# Altium schematic sheet Sheet2.SchDoc
size A3
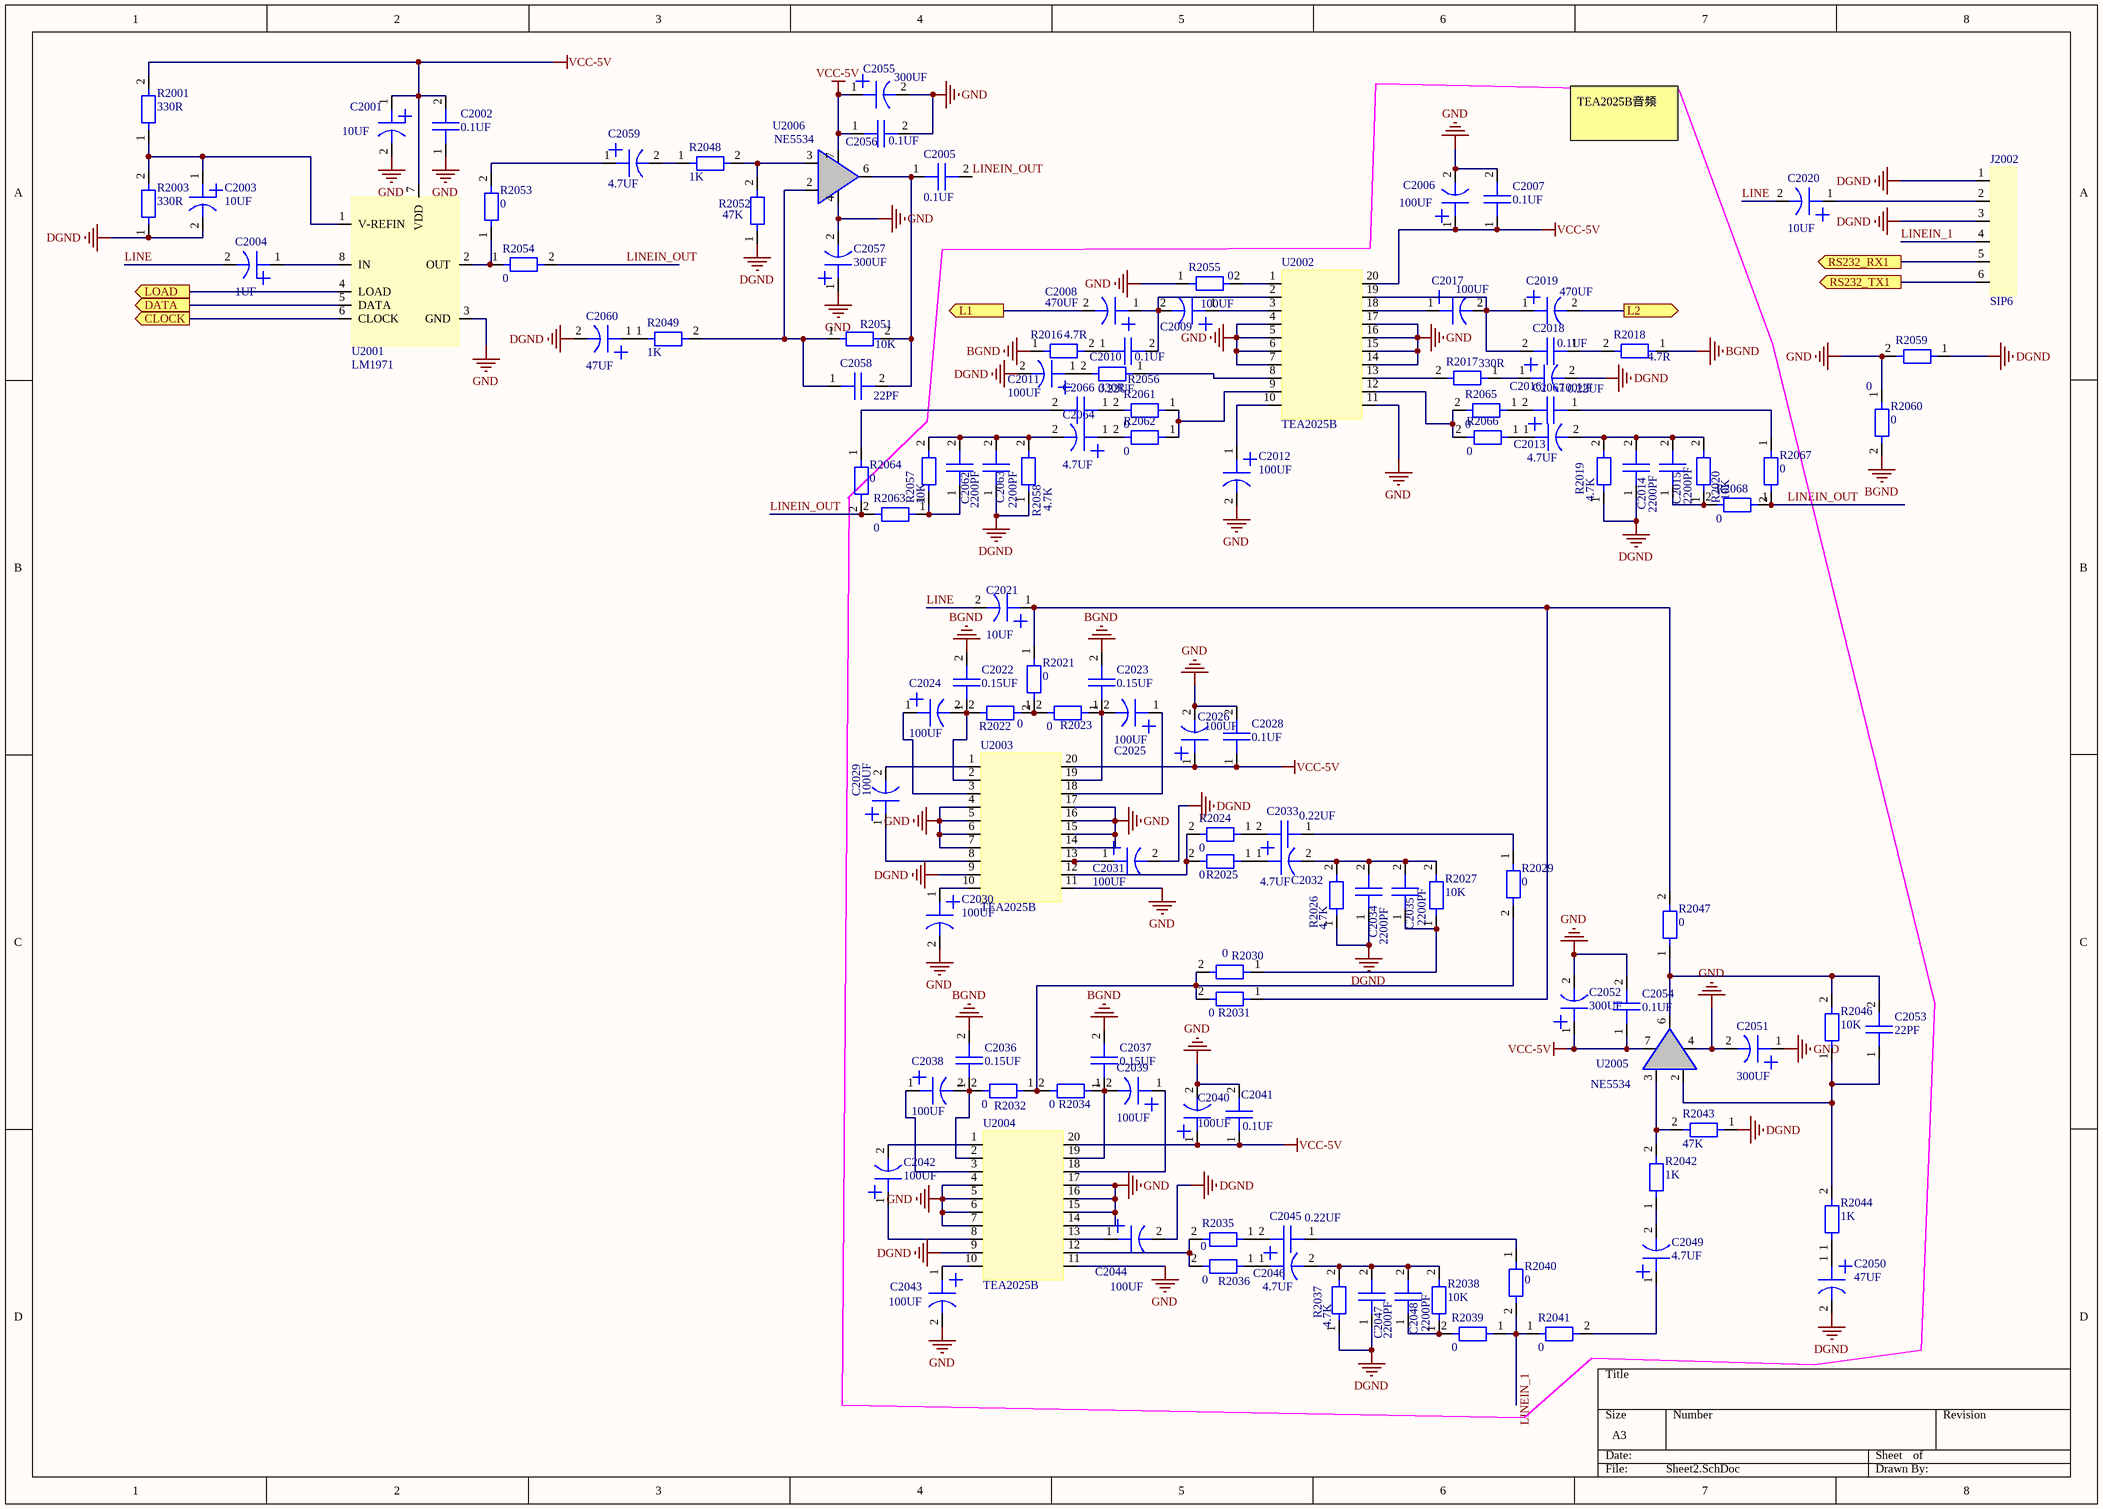
[diagram p0: Sheet2.SchDoc]

## Parts
C2001  10UF  [7343]
C2002  0.1UF  [0603]
C2003  10UF  [7343]
C2004  1UF  [7343]
C2005  0.1UF  [0603]
C2006  100UF  [7343]
C2007  0.1UF  [0603]
C2008  470UF  [7343]
C2009  100UF  [7343]
C2010  0.1UF  [0603]
C2011  100UF  [7343]
C2012  100UF  [7343]
C2013  4.7UF  [7343]
C2014  2200PF  [0603]
C2015  2200PF  [0603]
C2016  100UF  [7343]
C2017  100UF  [7343]
C2018  0.1UF  [0603]
C2019  470UF  [7343]
C2020  10UF  [7343]
C2021  10UF  [7343]
C2022  0.15UF  [0603]
C2023  0.15UF  [0603]
C2024  100UF  [7343]
C2025  100UF  [7343]
C2026  100UF  [7343]
C2028  0.1UF  [0603]
C2029  100UF  [7343]
C2030  100UF  [7343]
C2031  100UF  [7343]
C2032  4.7UF  [7343]
C2033  0.22UF  [0603]
C2034  2200PF  [0603]
C2035  2200PF  [0603]
C2036  0.15UF  [0603]
C2037  0.15UF  [0603]
C2038  100UF  [7343]
C2039  100UF  [7343]
C2040  100UF  [7343]
C2041  0.1UF  [0603]
C2042  100UF  [7343]
C2043  100UF  [7343]
C2044  100UF  [7343]
C2045  0.22UF  [0603]
C2046  4.7UF  [7343]
C2047  2200PF  [0603]
C2048  2200PF  [0603]
C2049  4.7UF  [7343]
C2050  47UF  [7343]
C2051  300UF  [7343]
C2052  300UF  [7343]
C2053  22PF  [0603]
C2054  0.1UF  [0603]
C2055  300UF  [7343]
C2056  0.1UF  [0603]
C2057  300UF  [7343]
C2058  22PF  [0603]
C2059  4.7UF  [7343]
C2060  47UF  [7343]
C2062  2200PF  [0603]
C2063  2200PF  [0603]
C2064  4.7UF  [7343]
C2066  0.22UF  [0603]
C2067  0.22UF  [0603]
J2002  SIP6  [SIP6]
R2001  330R  [0603]
R2003  330R  [0603]
R2016  4.7R  [0603]
R2017  330R  [0603]
R2018  4.7R  [0603]
R2019  4.7K  [0603]
R2020  10K  [0603]
R2021  0  [0603]
R2022  0  [0603]
R2023  0  [0603]
R2024  0  [0603]
R2025  0  [0603]
R2026  4.7K  [0603]
R2027  10K  [0603]
R2029  0  [0603]
R2030  0  [0603]
R2031  0  [0603]
R2032  0  [0603]
R2034  0  [0603]
R2035  0  [0603]
R2036  0  [0603]
R2037  4.7K  [0603]
R2038  10K  [0603]
R2039  0  [0603]
R2040  0  [0603]
R2041  0  [0603]
R2042  1K  [0603]
R2043  47K  [0603]
R2044  1K  [0603]
R2046  10K  [0603]
R2047  0  [0603]
R2048  1K  [0603]
R2049  1K  [0603]
R2051  10K  [0603]
R2052  47K  [0603]
R2053  0  [0603]
R2054  0  [0603]
R2055  0  [0603]
R2056  330R  [0603]
R2057  10K  [0603]
R2058  4.7K  [0603]
R2059  0  [0603]
R2060  0  [0603]
R2061  0  [0603]
R2062  0  [0603]
R2063  0  [0603]
R2064  0  [0603]
R2065  0  [0603]
R2066  0  [0603]
R2067  0  [0603]
R2068  0  [0603]
U2001  LM1971  [TJA1040]
U2002  TEA2025B  [TEA2025B]
U2003  TEA2025B  [TEA2025B]
U2004  TEA2025B  [TEA2025B]
U2005  NE5534  [SP2526A]
U2006  NE5534  [SP2526A]

## Ports
CLOCK (out), DATA (out), L1 (out), L2 (out), LOAD (out), RS232_RX1 (out), RS232_TX1 (out)

## Nets
BGND: C2022.2 C2023.2 C2036.2 C2037.2 R2016.1 R2018.1 R2060.2
DGND: C2003.2 C2011.2 C2014.1 C2016.2 C2031.2 C2034.1 C2044.2 C2047.1 C2050.2 C2060.2 C2063.1 J2002.1 J2002.3 R2003.1 R2019.1 R2026.1 R2037.1 R2043.1 R2052.1 R2058.1 R2059.1 U2003.9 U2004.9
GND: C2001.2 C2002.1 C2006.2 C2007.2 C2012.2 C2026.2 C2028.2 C2030.2 C2040.2 C2041.2 C2043.2 C2051.1 C2051.2 C2052.2 C2054.2 C2055.2 C2056.2 C2057.1 C2057.2 R2055.1 R2059.2 R2060.1 U2001.3(GND) U2002.4 U2002.5 U2002.6 U2002.7 U2002.11 U2002.14 U2002.15 U2002.16 U2002.17 U2003.4 U2003.5 U2003.6 U2003.7 U2003.11 U2003.14 U2003.15 U2003.16 U2003.17 U2004.4 U2004.5 U2004.6 U2004.7 U2004.11 U2004.14 U2004.15 U2004.16 U2004.17 U2005.4 U2006.4
VCC-5V: C2001.1 C2002.2 C2006.1 C2007.1 C2026.1 C2028.1 C2040.1 C2041.1 C2052.1 C2054.1 C2055.1 C2056.1 R2001.2 U2001.7(VDD) U2002.20 U2003.20 U2004.20 U2005.7 U2006.7
CLOCK: U2001.6(CLOCK) ; port CLOCK
DATA: U2001.5(DATA) ; port DATA
L1: C2008.2 ; port L1
L2: C2019.2 ; port L2
LINE: C2004.2 C2020.2 C2021.2
LINEIN_1: J2002.4 R2039.1 R2040.2 R2041.1
LINEIN_OUT: C2005.2 R2054.2 R2063.2 R2064.2 R2067.2 R2068.1
LOAD: U2001.4(LOAD) ; port LOAD
RS232_RX1: J2002.5 ; port RS232_RX1
RS232_TX1: J2002.6 ; port RS232_TX1
NetC2003_1: C2003.1 R2001.1 R2003.2 U2001.1(V-REFIN)
NetC2004_1: C2004.1 U2001.8(IN)
NetC2005_1: C2005.1 C2058.2 R2051.2 U2006.6
NetC2008_1: C2008.1 C2009.2 C2010.2 U2002.2
NetC2009_1: C2009.1 U2002.3
NetC2010_1: C2010.1 R2016.2
NetC2011_1: C2011.1 R2056.2
NetC2012_1: C2012.1 U2002.10
NetC2013_1: C2013.1 R2066.1
NetC2013_2: C2013.2 C2014.2 C2015.2 R2019.2 R2020.2
NetC2015_1: C2015.1 R2020.1 R2068.2
NetC2016_1: C2016.1 R2017.1
NetC2017_1: C2017.1 U2002.18
NetC2017_2: C2017.2 C2018.2 C2019.1 U2002.19
NetC2018_1: C2018.1 R2018.2
NetC2020_1: C2020.1 J2002.2
NetC2021_1: C2021.1 R2021.1 R2031.1 R2047.2
NetC2022_1: C2022.1 C2024.2 R2022.2 U2003.2
NetC2023_1: C2023.1 C2025.2 R2023.1 U2003.19
NetC2024_1: C2024.1 U2003.3
NetC2025_1: C2025.1 U2003.18
NetC2029_1: C2029.1 U2003.8
NetC2029_2: C2029.2 U2003.1
NetC2030_1: C2030.1 U2003.10
NetC2031_1: C2031.1 U2003.13
NetC2032_1: C2032.1 R2025.1
NetC2032_2: C2032.2 C2034.2 C2035.2 R2026.2 R2027.2
NetC2033_1: C2033.1 R2029.1
NetC2033_2: C2033.2 R2024.1
NetC2035_1: C2035.1 R2027.1 R2030.1
NetC2036_1: C2036.1 C2038.2 R2032.2 U2004.2
NetC2037_1: C2037.1 C2039.2 R2034.1 U2004.19
NetC2038_1: C2038.1 U2004.3
NetC2039_1: C2039.1 U2004.18
NetC2042_1: C2042.1 U2004.8
NetC2042_2: C2042.2 U2004.1
NetC2043_1: C2043.1 U2004.10
NetC2044_1: C2044.1 U2004.13
NetC2045_1: C2045.1 R2040.1
NetC2045_2: C2045.2 R2035.1
NetC2046_1: C2046.1 R2036.1
NetC2046_2: C2046.2 C2047.2 C2048.2 R2037.2 R2038.2
NetC2048_1: C2048.1 R2038.1 R2039.2
NetC2049_1: C2049.1 R2041.2
NetC2049_2: C2049.2 R2042.1
NetC2050_1: C2050.1 R2044.1
NetC2053_1: C2053.1 R2044.2 R2046.1 U2005.2
NetC2053_2: C2053.2 R2046.2 R2047.1 U2005.6
NetC2058_1: C2058.1 R2049.2 R2051.1 U2006.2
NetC2059_1: C2059.1 R2053.2
NetC2059_2: C2059.2 R2048.1
NetC2060_1: C2060.1 R2049.1
NetC2062_1: C2062.1 R2057.1 R2063.1
NetC2062_2: C2062.2 C2063.2 C2064.2 R2057.2 R2058.2
NetC2064_1: C2064.1 R2062.2
NetC2066_1: C2066.1 R2061.2
NetC2066_2: C2066.2 R2064.1
NetC2067_1: C2067.1 R2067.1
NetC2067_2: C2067.2 R2065.1
NetR2017_2: R2017.2 U2002.13
NetR2021_2: R2021.2 R2022.1 R2023.2
NetR2024_2: R2024.2 R2025.2 U2003.12
NetR2029_2: R2029.2 R2030.2 R2031.2 R2032.1 R2034.2
NetR2035_2: R2035.2 R2036.2 U2004.12
NetR2042_2: R2042.2 R2043.2 U2005.3
NetR2048_2: R2048.2 R2052.2 U2006.3
NetR2053_1: R2053.1 R2054.1 U2001.2(OUT)
NetR2055_2: R2055.2 U2002.1
NetR2056_1: R2056.1 U2002.8
NetR2061_1: R2061.1 R2062.1 U2002.9
NetR2065_2: R2065.2 R2066.2 U2002.12

## Notes on the sheet
- TEA2025B音频

## Library data of the parts
C2001 C2003 C2004 = EC
C2002 C2005 C2007 C2010 C2014 C2015 C2018 C2022 C2023 C2028 C2033-C2037 C2041 C2045 C2047 C2048 C2053 C2054 C2056 C2058 C2062 C2063 C2066 C2067 = C
C2006 C2008 C2009 C2011-C2013 C2016 C2017 C2019-C2021 C2024-C2026 C2029-C2032 C2038-C2040 C2042-C2044 C2046 C2049-C2052 C2055 C2057 C2059 C2060 C2064 = JC
R2001 R2003 R2016-R2027 R2029-R2032 R2034-R2044 R2046-R2049 R2051-R2068 = R